# Altium schematic sheet allaki_mezz_top.SchDoc: =ProjectName
size 420 x 297 mm; Author: SBH; CompanyName: WUT; DrawnBy: SBH; Organization: ISE-WUT; Address1: Warsaw Univeristy of Technology; Address2: Nowowiejska 15/19; Revision: -; SheetNumber: 1; EDA_Number: ARTIQ; Projet: ADC/DAC MEZZANINE; ModifiedBy: -; CreateDate: XX/XX/XXXX; CheckedDate: -; Title2: allaki_mezz_top.SchDoc; DivGrp: ISE; Designer: SBH; ModifiedDate: -; ProjectName: ADC/DAC MEZZANINE
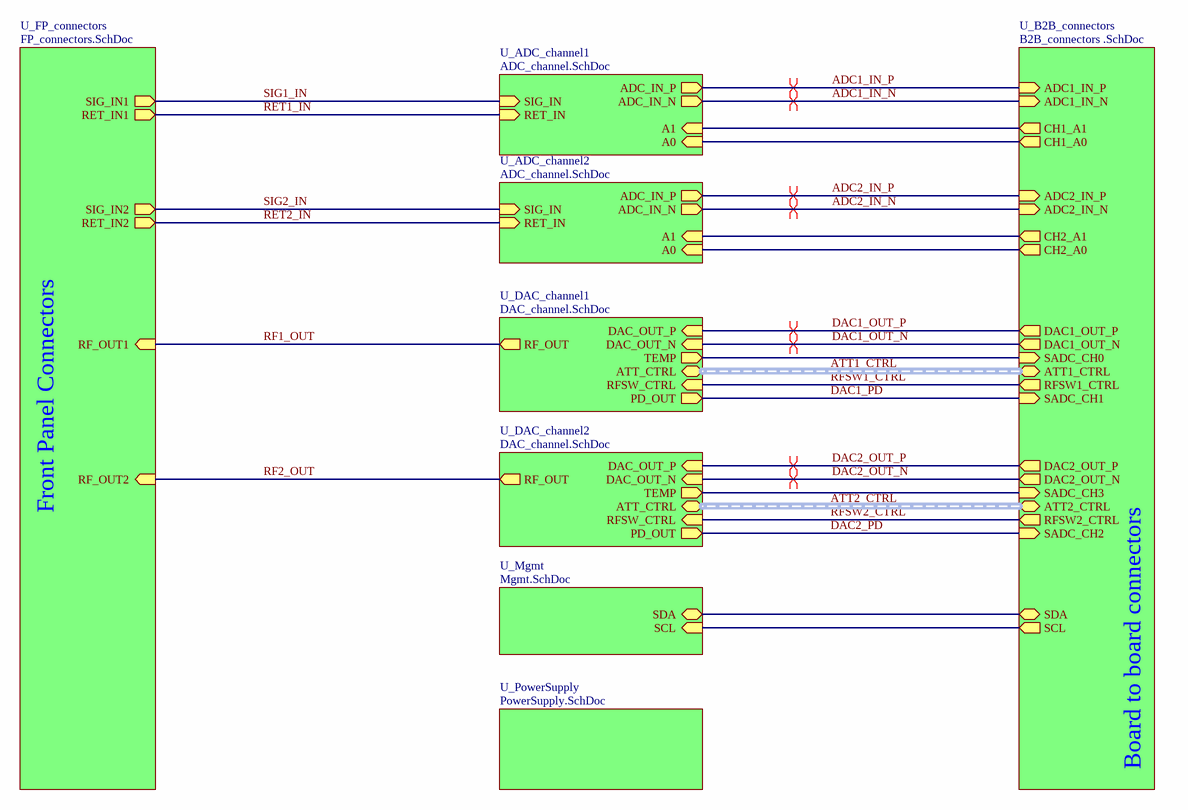
[diagram p0: allaki_mezz_top.SchDoc]

## Sub-sheets
U_ADC_channel1 = ADC_channel.SchDoc: ADC_IN_N (out), ADC_IN_P (out), SIG_IN (in), RET_IN (in), A1 (in), A0 (in)
U_ADC_channel2 = ADC_channel.SchDoc: ADC_IN_P (out), ADC_IN_N (out), SIG_IN (in), RET_IN (in), A1 (in), A0 (in)
U_B2B_connectors = B2B_connectors .SchDoc: ADC1_IN_N (in), ADC1_IN_P (in), DAC1_OUT_N (out), DAC1_OUT_P (out), DAC2_OUT_N (out), DAC2_OUT_P (out), ADC2_IN_N (in), ADC2_IN_P (in), ATT1_CTRL (harness ATT_CTRL), ATT2_CTRL (harness ATT_CTRL), RFSW1_CTRL (out), RFSW2_CTRL (out), SDA (bidir), SCL (out), SADC_CH2 (in), SADC_CH1 (in), CH1_A0 (out), CH2_A1 (out), CH1_A1 (out), CH2_A0 (out), SADC_CH0 (in), SADC_CH3 (in)
U_DAC_channel1 = DAC_channel.SchDoc: DAC_OUT_P (in), DAC_OUT_N (in), RF_OUT (out), ATT_CTRL (harness ATT_CTRL), RFSW_CTRL (in), PD_OUT (out), TEMP (out)
U_DAC_channel2 = DAC_channel.SchDoc: DAC_OUT_P (in), DAC_OUT_N (in), RF_OUT (out), RFSW_CTRL (in), ATT_CTRL (harness ATT_CTRL), PD_OUT (out), TEMP (out)
U_FP_connectors = FP_connectors.SchDoc: RF_OUT1 (in), RF_OUT2 (in), SIG_IN1 (out), SIG_IN2 (out), RET_IN1 (out), RET_IN2 (out)
U_Mgmt = Mgmt.SchDoc: SDA (bidir), SCL (in)
U_PowerSupply = PowerSupply.SchDoc: no entries

## Nets
ADC1_IN_N: sheet U_ADC_channel1/ADC_IN_N, sheet U_B2B_connectors/ADC1_IN_N
ADC1_IN_P: sheet U_ADC_channel1/ADC_IN_P, sheet U_B2B_connectors/ADC1_IN_P
ADC2_IN_N: sheet U_ADC_channel2/ADC_IN_N, sheet U_B2B_connectors/ADC2_IN_N
ADC2_IN_P: sheet U_ADC_channel2/ADC_IN_P, sheet U_B2B_connectors/ADC2_IN_P
DAC1_OUT_N: sheet U_DAC_channel1/DAC_OUT_N, sheet U_B2B_connectors/DAC1_OUT_N
DAC1_OUT_P: sheet U_DAC_channel1/DAC_OUT_P, sheet U_B2B_connectors/DAC1_OUT_P
DAC1_PD: sheet U_DAC_channel1/PD_OUT, sheet U_B2B_connectors/SADC_CH1
DAC2_OUT_N: sheet U_DAC_channel2/DAC_OUT_N, sheet U_B2B_connectors/DAC2_OUT_N
DAC2_OUT_P: sheet U_DAC_channel2/DAC_OUT_P, sheet U_B2B_connectors/DAC2_OUT_P
DAC2_PD: sheet U_DAC_channel2/PD_OUT, sheet U_B2B_connectors/SADC_CH2
RET1_IN: sheet U_ADC_channel1/RET_IN, sheet U_FP_connectors/RET_IN1
RET2_IN: sheet U_ADC_channel2/RET_IN, sheet U_FP_connectors/RET_IN2
RF1_OUT: sheet U_DAC_channel1/RF_OUT, sheet U_FP_connectors/RF_OUT1
RF2_OUT: sheet U_DAC_channel2/RF_OUT, sheet U_FP_connectors/RF_OUT2
RFSW1_CTRL: sheet U_DAC_channel1/RFSW_CTRL, sheet U_B2B_connectors/RFSW1_CTRL
RFSW2_CTRL: sheet U_DAC_channel2/RFSW_CTRL, sheet U_B2B_connectors/RFSW2_CTRL
SIG1_IN: sheet U_ADC_channel1/SIG_IN, sheet U_FP_connectors/SIG_IN1
SIG2_IN: sheet U_ADC_channel2/SIG_IN, sheet U_FP_connectors/SIG_IN2
(unnamed): sheet U_ADC_channel1/A1, sheet U_B2B_connectors/CH1_A1
(unnamed): sheet U_ADC_channel1/A0, sheet U_B2B_connectors/CH1_A0
(unnamed): sheet U_DAC_channel1/TEMP, sheet U_B2B_connectors/SADC_CH0
(unnamed): sheet U_ADC_channel2/A1, sheet U_B2B_connectors/CH2_A1
(unnamed): sheet U_ADC_channel2/A0, sheet U_B2B_connectors/CH2_A0
(unnamed): sheet U_DAC_channel2/TEMP, sheet U_B2B_connectors/SADC_CH3
(unnamed): sheet U_B2B_connectors/SDA, sheet U_Mgmt/SDA
(unnamed): sheet U_B2B_connectors/SCL, sheet U_Mgmt/SCL

## Buses and harness runs
harness ATT1_CTRL = sheet U_B2B_connectors/ATT1_CTRL = sheet U_DAC_channel1/ATT_CTRL
harness ATT2_CTRL = sheet U_B2B_connectors/ATT2_CTRL = sheet U_DAC_channel2/ATT_CTRL

## Layout directives
differential pair: ADC1_IN_N, ADC1_IN_P, ADC2_IN_N, ADC2_IN_P, DAC1_OUT_N, DAC1_OUT_P, DAC2_OUT_N, DAC2_OUT_P

## Notes on the sheet
- Front Panel Connectors
- Board to board connectors
- Project/Equipment
- Document
- Designer
- Drawn by
- Check.by
- File
- Last Mod.
- Print Date
- Sheet
- Size
- A3
- of
- Rev